# EAGLE schematic OECOC_controlbord (EAGLE 9.6.2)
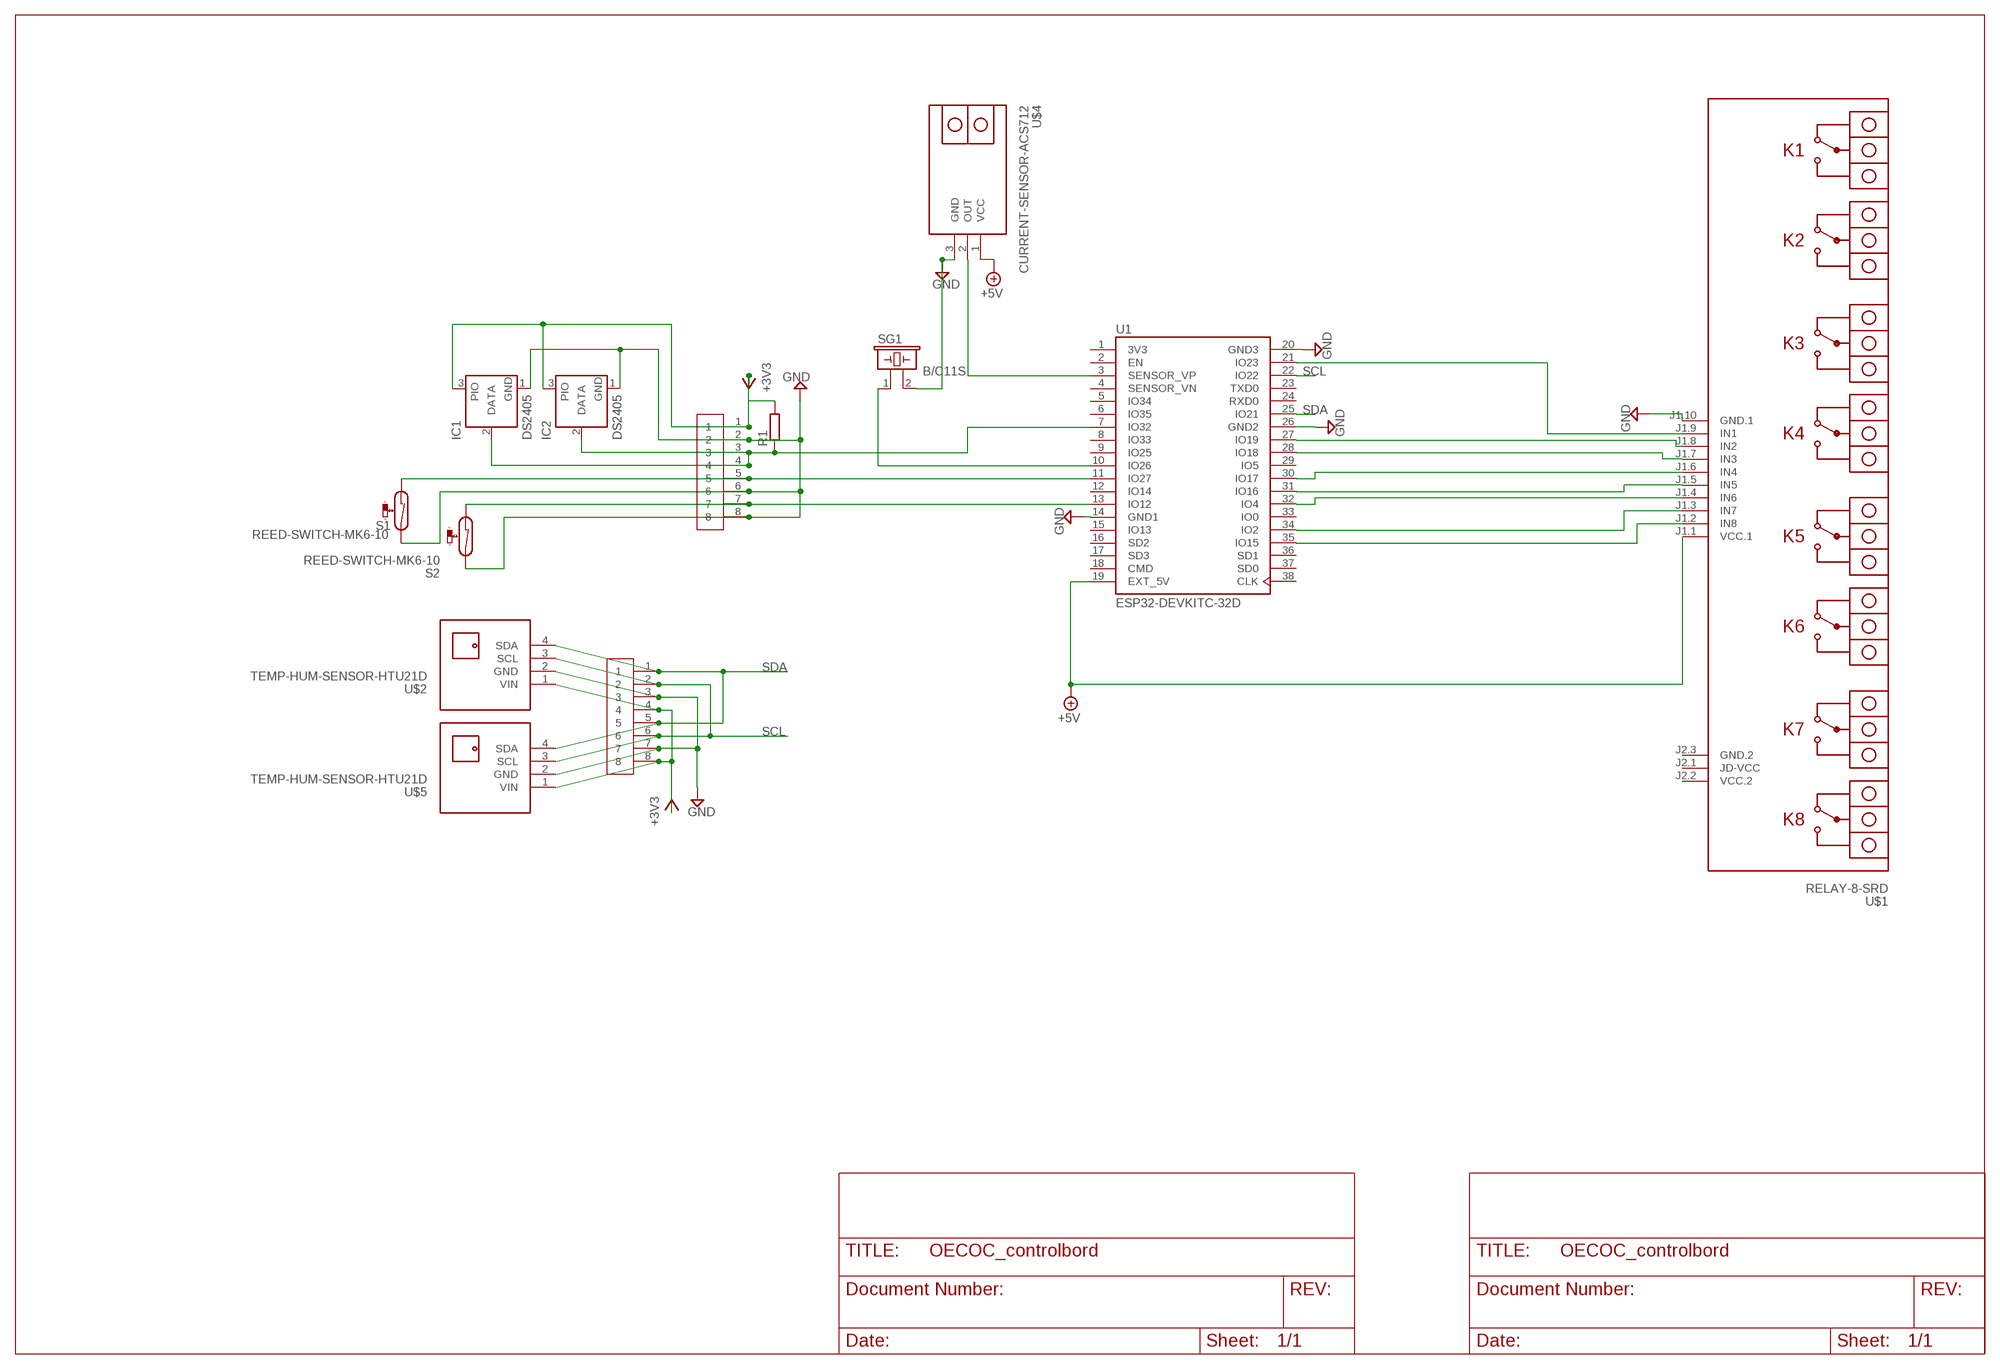
[diagram p0: schematic, sheet 1]

## Parts
IC1  DS2405  [TO92-]
IC2  DS2405  [TO92-]
R1  R-EU_0207/10  [0207/10]
S1  REED-SWITCH-MK6-10  [MK6-10]
S2  REED-SWITCH-MK6-10  [MK6-10]
SG1  B/C11S  [B/C11S]
U1  ESP32-DEVKITC-32D  [MODULE_ESP32-DEVKITC-32D]
U$1  RELAY-8-SRD  [RELAY-8-SRD]
U$2  TEMP-HUM-SENSOR-HTU21D  [TEMP-HUM-SENSOR-HTU21D]
U$3  PHOENIXCONTACT_PINSTRIP  [HDRV8W150P500_1X8_2488X140X1204B]
U$4  CURRENT-SENSOR-ACS712  [CURRENT-SENSOR-ACS712]
U$5  TEMP-HUM-SENSOR-HTU21D  [TEMP-HUM-SENSOR-HTU21D]
U$6  PHOENIXCONTACT_PINSTRIP  [HDRV8W150P500_1X8_2488X140X1204B]

## Nets
+3V3: IC1.3(PIO) IC2.3(PIO) R1.2 U$2.1(VIN) U$3.4 U$3.8 U$5.1(VIN) U$6.1
+5V: U1.19(EXT_5V) U$1.J1.1(VCC.1) U$4.1(VCC)
GND: IC1.1(GND) IC2.1(GND) S1.2 S2.2 SG1.2 U1.14(GND1) U1.20(GND3) U1.26(GND2) U$1.J1.10(GND.1) U$2.2(GND) U$3.3 U$3.7 U$4.3(GND) U$5.2(GND) U$6.2 U$6.6 U$6.8
N$1: U1.3(SENSOR_VP) U$4.2(OUT)
N$2: U1.32(IO4) U$1.J1.4(IN6)
N$3: U1.31(IO16) U$1.J1.5(IN5)
N$4: U1.30(IO17) U$1.J1.6(IN4)
N$5: U1.28(IO18) U$1.J1.7(IN3)
N$6: U1.35(IO15) U$1.J1.2(IN8)
N$7: U1.34(IO2) U$1.J1.3(IN7)
N$8: U1.27(IO19) U$1.J1.8(IN2)
N$9: U1.21(IO23) U$1.J1.9(IN1)
N$10: S1.1 U1.11(IO27) U$6.5
N$11: SG1.1 U1.10(IO26)
N$13: IC1.2(DATA) IC2.2(DATA) R1.1 U1.7(IO32) U$6.3 U$6.4
N$14: S2.1 U1.13(IO12) U$6.7
SCL: U1.22(IO22) U$2.3(SCL) U$3.2 U$3.6 U$5.3(SCL)
SDA: U1.25(IO21) U$2.4(SDA) U$3.1 U$3.5 U$5.4(SDA)
Unconnected: U1.2(EN) U1.4(SENSOR_VN) U1.5(IO34) U1.6(IO35) U1.8(IO33) U1.9(IO25) U1.12(IO14) U1.15(IO13) U1.16(SD2) U1.17(SD3) U1.18(CMD) U1.23(TXD0) U1.24(RXD0) U1.29(IO5) U1.33(IO0) U1.36(SD1) U1.37(SD0) U1.38(CLK) U$1.J2.1(JD-VCC)

## Power pins joined to a net without a drawn wire
3V3: U1.1(3V3)
GND.2: U$1.J2.3(GND.2)
VCC.2: U$1.J2.2(VCC.2)

## Library data of the parts
IC1 IC2 = maxim:DS2405: Addressable Switch DALLAS Semiconductor; MF: DALLAS SEMICONDUCTOR; MPN: DS2405; OC_FARNELL: 1188025; OC_NEWARK: 06F4645
R1 = rcl:R-EU_: RESISTOR, European symbol; SPICEPREFIX: R
S1 S2 = switch-reed:REED-SWITCH-: Reed Sensor; OC_FARNELL: unknown
SG1 = buzzer:B/C11S: BUZZER Source: Buerklin; OC_FARNELL: unknown; OC_NEWARK: unknown
U1 = Personal:ESP32-DEVKITC-32D: Eval Board For Esp-Wroom-32 Check prices <https://pricing.snapeda.com/parts/ESP32-DEVKITC-32D/Espressif%20Systems/view-part?ref=eda>; AVAILABILITY: In Stock; DESCRIPTION: WiFi Development Tools (802.11) ESP32 General Development Kit, ESP32-WROOM-32D on the board; MF: Espressif Systems; MP: ESP32-DEVKITC-32D; PACKAGE: None; PRICE: None; PURCHASE-URL: https://pricing.snapeda.com/search/part/ESP32-DEVKITC-32D/?ref=eda
U$1 = diy-modules:RELAY-8-SRD: 8-Channel Relay Module based on SRD-05VDC-SL-C relays Click here to find device on ebay.com <http://www.ebay.com/sch/eight+channel+relay+module+optocoupler+5v>
U$2 U$5 = diy-modules:TEMP-HUM-SENSOR-HTU21D: Digital Humidity & Temperature Sensor based on HTU21D device More information about HTU21D device is available here: http://futureeverything.org/wp-content/uploads/2014/05/Humidity-Datasheet.pdf HTU21D Arudino Library is available here: https://learn.sparkfun.com/tutorials/htu21d-humidity-sensor-hookup-guide/htu21d-library-and-functions Click here to find device on ebay.com <http://www.ebay.com/sch/htu21d+board>
U$3 U$6 = Personal:PHOENIXCONTACT_PINSTRIP
U$4 = diy-modules:CURRENT-SENSOR-ACS712: Isolated Bipolar Current Sensors based on ACS712 chip More details available here: http://embedded-lab.com/blog/a-brief-overview-of-allegro-acs712-current-sensor-part-1/ Click here to find device on ebay.com <http://www.ebay.com/sch/acs712+module> Note: There are many available versions with different pinout. Please check before use